# Altium schematic sheet PLD_RTC.SchDoc: RTC
size A4; ApprovedBy: Piotr Kuligowski; CheckedBy: Piotr Kuligowski; Author: Michał Gumiela; SheetNumber: 11; SheetTotal: 13
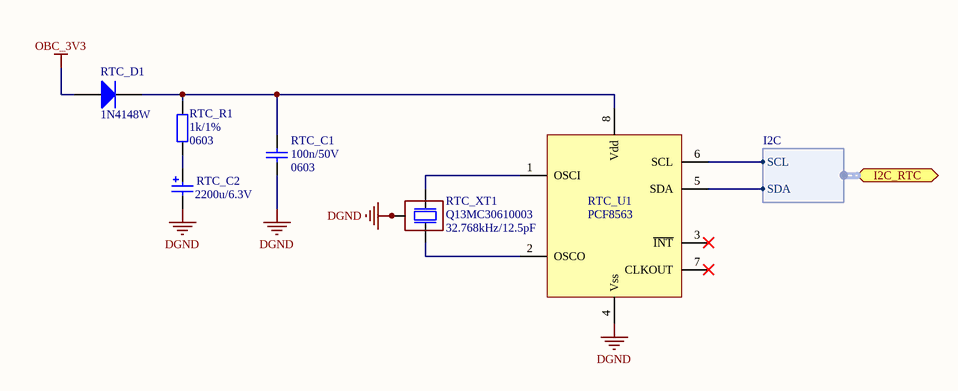
[diagram p0: PLD_RTC.SchDoc]

## Parts
RTC_C1  Package: 0603  [SMD_Capacitor_0603]  (hidden comment: 100n/50V)
RTC_C2  2200u/6.3V  [Tant_592D_X]
RTC_D1  1N4148W  [SOD-123]
RTC_R1  Package: 0603  [SMD_Resistor_0603]  (hidden comment: 1k/1%)
RTC_U1  (no value)  [TSSOP8_L]
RTC_XT1  32.768kHz/12.5pF  [Epson_MC-306]

## Ports
I2C_RTC (harness I2C)

## Harnesses
I2C: SDA, SCL

## Nets
DGND: RTC_C1.2 RTC_C2.2 RTC_U1.4(Vss) RTC_XT1.2(NC) RTC_XT1.3(NC)
OBC_3V3: RTC_D1.A
NetRTC_C1_1: RTC_C1.1 RTC_D1.K RTC_R1.1 RTC_U1.8(Vdd)
NetRTC_C2_1: RTC_C2.1 RTC_R1.2
NetRTC_U1_1: RTC_U1.1(OSCI) RTC_XT1.1(inp)
NetRTC_U1_2: RTC_U1.2(OSCO) RTC_XT1.4(out)
NetRTC_U1_5: RTC_U1.5(SDA) ; port I2C_RTC.SDA
NetRTC_U1_6: RTC_U1.6(SCL) ; port I2C_RTC.SCL

Not connected (* = marked no-connect by the designer): RTC_U1 3(~{INT})* 7(CLKOUT)*

## Notes on the sheet
- Title:
- Project:
- Author:
- Model:
- Document Number:
- Checked by:
- Rev:
- Date:
- Approved by:
- Sheet:
- of
- File name:

## Library data of the parts
RTC_C1 = Cer_C0603T104K5RALTU: Ceramic Cap Kemet COTS 100n/50V X7R 0603; Manufacturer: Kemet; ManufacturerPartNumber: C0603T104K5RALTU; Value: 100n/50V
RTC_C2 = Tant_592D228X96R3X2T20H: Vishay 592D Solid Tantalum Chip Capacitors.; ManufacturerPartNumber: 592D228X96R3X2T20H; Manufacturer: Vishay; Value: 2200u/6.3V
RTC_D1 = 1N4148W: Small Signal Fast Switching Diode; Manufacturer: Vishay; Value: 1N4148W
RTC_R1 = CRCW06031K00FKxxxx: 1k/1% Vishay CRCW 0603 Resistor. 100mW, 100ppm, 75V.; Manufacturer: Vishay; ManufacturerPartNumber: CRCW06031K00FKxxxx; Value: 1k/1%
RTC_U1 = PCF8563: Real-time clock/calendar; Manufacturer: NXP; HelpUrl: http://www.nxp.com/documents/data_sheet/PCF8563.pdf; ManufacturerPartNumber: PCF8563
RTC_XT1 = Q13MC30610003: EPSON MC-306 32.768KHZ 12.5pF Crystal; Manufacturer: Epson; ManufacturerPartNumber: Q13MC30610003; Value: 32.768kHz/12.5pF